# Altium schematic sheet STC51.SchDoc
size A4
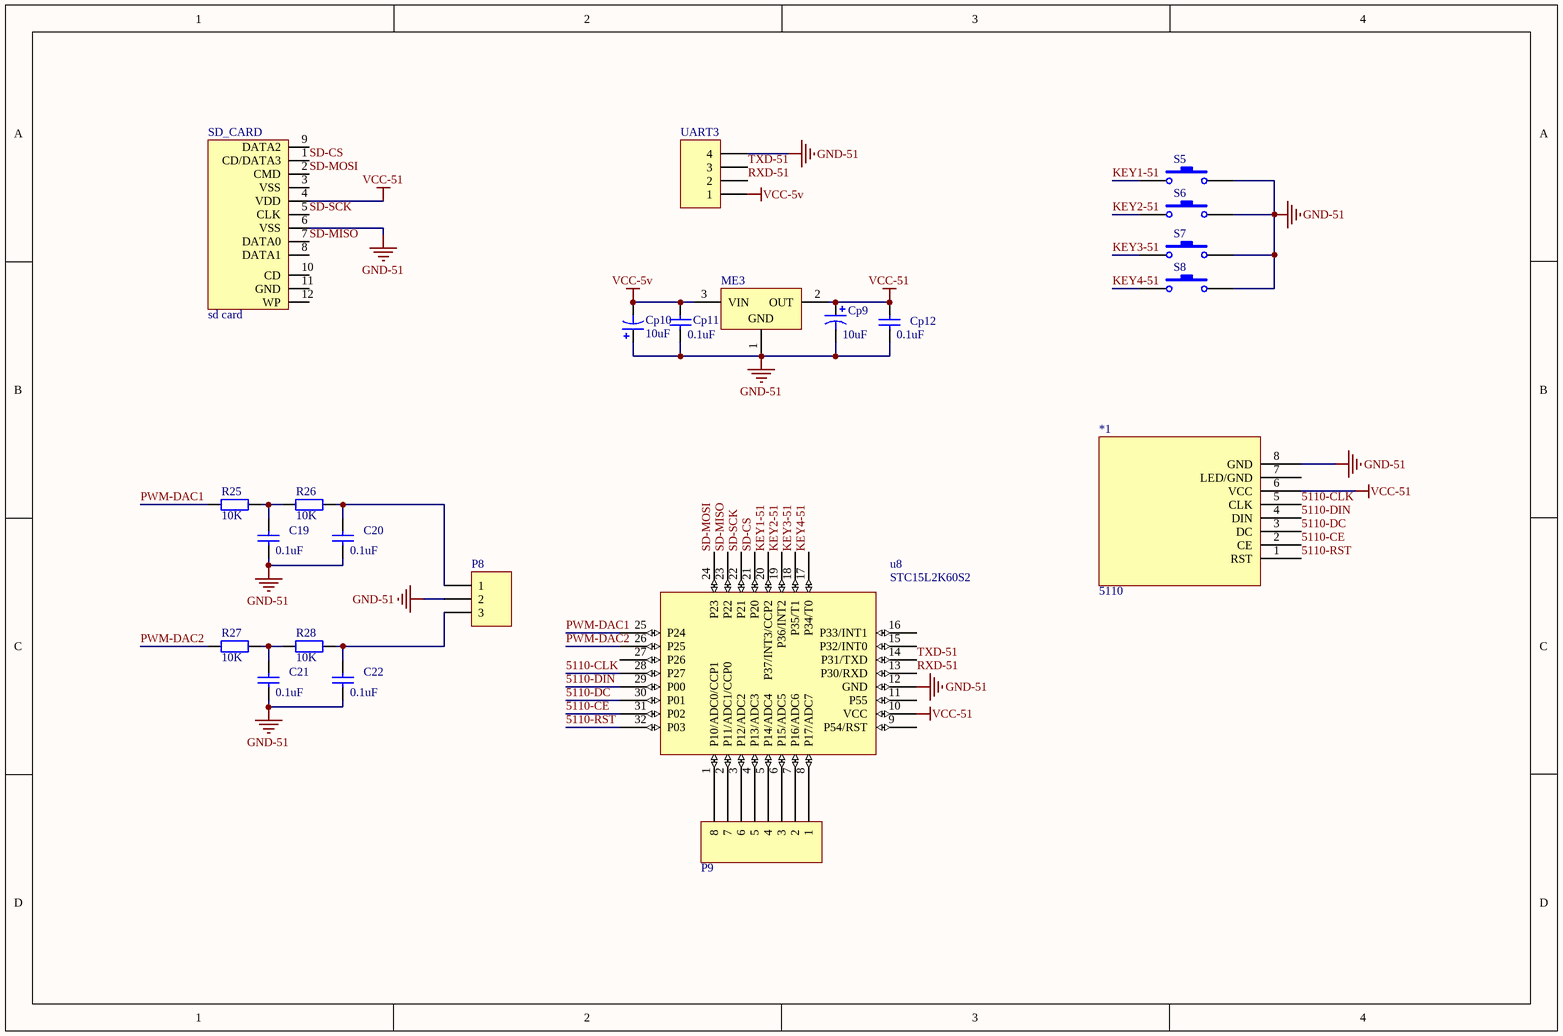
[diagram p0: STC51.SchDoc]

## Parts
*1  5110  [5110]
C19  value 0.1uF  [0805s]  (hidden comment: Cap)
C20  value 0.1uF  [0805s]  (hidden comment: Cap)
C21  value 0.1uF  [0805s]  (hidden comment: Cap)
C22  value 0.1uF  [0805s]  (hidden comment: Cap)
Cp9  value 10uF  [3216]  (hidden comment: Cap Pol1)
Cp10  value 10uF  [3216]  (hidden comment: Cap Pol1)
Cp11  value 0.1uF  [0805]  (hidden comment: Cap)
Cp12  value 0.1uF  [0805]  (hidden comment: Cap)
ME3  Volt Reg  [SOT-23]  (value not drawn)
P8  Header 3  [HDR1X3]  (value not drawn)
P9  Header 8  [HDR1X8]  (value not drawn)
R25  value 10K  [0805s]  (hidden comment: Res2)
R26  value 10K  [0805s]  (hidden comment: Res2)
R27  value 10K  [0805s]  (hidden comment: Res2)
R28  value 10K  [0805s]  (hidden comment: Res2)
S5  SW-PB  [按键]  (value not drawn)
S6  SW-PB  [按键]  (value not drawn)
S7  SW-PB  [按键]  (value not drawn)
S8  SW-PB  [按键]  (value not drawn)
SD_CARD  sd card  [SD卡]
u8  STC15L2K60S2  [LQFP-32]
UART3  Header 4  [HDR1X4]  (value not drawn)

## Nets
GND-51: *1.8(GND) C19.1 C20.1 C21.1 C22.1 Cp9.2 Cp10.1 Cp11.1 Cp12.1 ME3.1(GND) P8.2 S5.2 S6.2 S7.2 S8.2 SD_CARD.6(VSS) u8.12(GND) UART3.4
VCC-5v: Cp10.2 Cp11.2 ME3.3(VIN) UART3.1
VCC-51: *1.6(VCC) Cp9.1 Cp12.2 ME3.2(OUT) SD_CARD.4(VDD) u8.10(VCC)
5110-CE: *1.2(CE) u8.31(P02)
5110-CLK: *1.5(CLK) u8.28(P27)
5110-DC: *1.3(DC) u8.30(P01)
5110-DIN: *1.4(DIN) u8.29(P00)
5110-RST: *1.1(RST) u8.32(P03)
KEY1-51: S5.1 u8.20(P37/INT3/CCP2)
KEY2-51: S6.1 u8.19(P36/INT2)
KEY3-51: S7.1 u8.18(P35/T1)
KEY4-51: S8.1 u8.17(P34/T0)
PWM-DAC1: R25.2 u8.25(P24)
PWM-DAC2: R27.2 u8.26(P25)
RXD-51: u8.13(P30/RXD) UART3.2
SD-CS: SD_CARD.1(CD/DATA3) u8.21(P20)
SD-MISO: SD_CARD.7(DATA0) u8.23(P22)
SD-MOSI: SD_CARD.2(CMD) u8.24(P23)
SD-SCK: SD_CARD.5(CLK) u8.22(P21)
TXD-51: u8.14(P31/TXD) UART3.3
NetC19_2: C19.2 R25.1 R26.2
NetC20_2: C20.2 P8.1 R26.1
NetC21_2: C21.2 R27.1 R28.2
NetC22_2: C22.2 P8.3 R28.1
NetP9_1: P9.1 u8.8(P17/ADC7)
NetP9_2: P9.2 u8.7(P16/ADC6)
NetP9_3: P9.3 u8.6(P15/ADC5)
NetP9_4: P9.4 u8.5(P14/ADC4)
NetP9_5: P9.5 u8.4(P13/ADC3)
NetP9_6: P9.6 u8.3(P12/ADC2)
NetP9_7: P9.7 u8.2(P11/ADC1/CCP0)
NetP9_8: P9.8 u8.1(P10/ADC0/CCP1)

Not connected (* = marked no-connect by the designer): *1 7(LED/GND); SD_CARD 3(VSS) 8(DATA1) 9(DATA2) 10(CD) 11(GND) 12(WP); u8 9(P54/RST) 11(P55) 15(P32/INT0) 16(P33/INT1) 27(P26)

## Library data of the parts
C19-C22 Cp11 Cp12 = Cap: Capacitor; Published: 8-Jun-2000; LatestRevisionDate: 17-Jul-2002; LatestRevisionNote: Re-released for DXP Platform.; PackageReference: RAD-0.3; Publisher: Altium Limited
Cp9 Cp10 = Cap Pol1: Polarized Capacitor (Radial); Published: 8-Jun-2000; LatestRevisionDate: 17-Jul-2002; LatestRevisionNote: Re-released for DXP Platform.; PackageReference: RB7.6-15; Publisher: Altium Limited
ME3 = Volt Reg: Voltage Regulator; Published: 24-Mar-1999; LatestRevisionDate: 29-May-2009; LatestRevisionNote: IPC-7351 Footprint Added.; PackageReference: D2PAK; Publisher: Altium Limited; PackageDescription: 3-Pin Transistor Outline Package 2.54 mm Pitch, 15.1 mm Lead Span
P8 = Header 3: Header, 3-Pin; LatestRevisionDate: 17-Jul-2002; LatestRevisionNote: Re-released for DXP Platform.; Publisher: Altium Limited
P9 = Header 8: Header, 8-Pin; LatestRevisionDate: 17-Jul-2002; LatestRevisionNote: Re-released for DXP Platform.; Publisher: Altium Limited
R25-R28 = Res2: Resistor; Published: 8-Jun-2000; LatestRevisionDate: 17-Jul-2002; LatestRevisionNote: Re-released for DXP Platform.; PackageReference: AXIAL-0.4; Publisher: Altium Limited
S5-S8 = SW-PB: Switch; Published: 24-Mar-1999; LatestRevisionDate: 17-Jul-2002; LatestRevisionNote: Re-released for DXP Platform.; PackageReference: SPST-2; Publisher: Altium Limited
UART3 = Header 4: Header, 4-Pin; LatestRevisionDate: 17-Jul-2002; LatestRevisionNote: Re-released for DXP Platform.; Publisher: Altium Limited